# Altium schematic sheet Isolated DAC.SchDoc
size A4
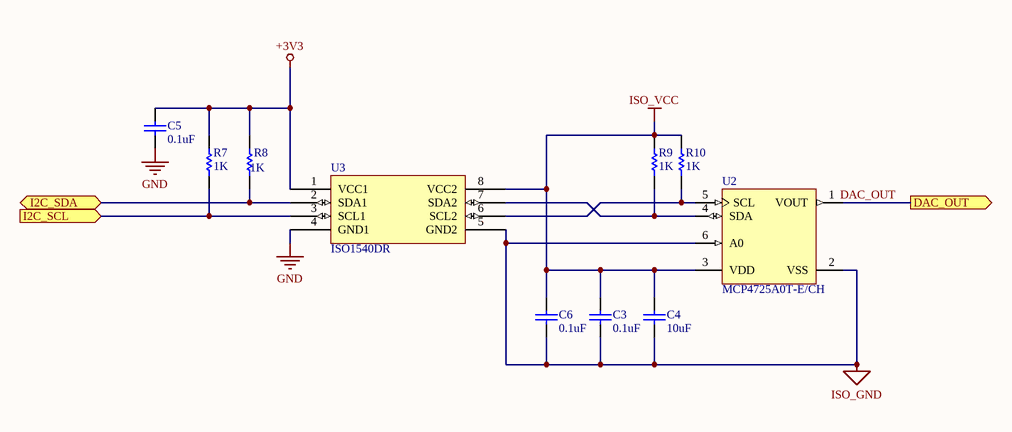
[diagram p0: Isolated DAC.SchDoc]

## Parts
C3  0.1uF  [CAPC1608X87X35NL15T15]
C4  10uF  [CAPC1608X90X35NL10T15]
C5  0.1uF  [CAPC1608X87X35NL15T15]
C6  0.1uF  [CAPC1608X87X35NL15T15]
R7  1K  [RESC1608X55X30LL15T15]
R8  1K  [RESC1608X55X30LL15T15]
R9  1K  [RESC1608X55X30LL15T15]
R10  1K  [RESC1608X55X30LL15T15]
U2  MCP4725A0T-E/CH  [SOT-23-CH6_L]
U3  ISO1540DR  [ISO1540DR SOIC127P600X175-8N]

## Ports
DAC_OUT (out), I2C_SCL (in), I2C_SDA (bidir)

## Nets
+3V3: C5.1 R7.2 R8.2 U3.1(VCC1)
GND: C5.2 U3.4(GND1)
ISO_GND: C3.2 C4.1 C6.2 U2.2(VSS) U2.6(A0) U3.5(GND2)
ISO_VCC: C3.1 C4.2 C6.1 R9.2 R10.2 U2.3(VDD) U3.8(VCC2)
DAC_OUT: U2.1(VOUT) ; port DAC_OUT
I2C_SCL: R7.1 U3.3(SCL1) ; port I2C_SCL
I2C_SDA: R8.1 U3.2(SDA1) ; port I2C_SDA
NetR9_1: R9.1 U2.4(SDA) U3.7(SDA2)
NetR10_1: R10.1 U2.5(SCL) U3.6(SCL2)

## Library data of the parts
C3 C5 C6 = CMP-2006-03300-1: Part Number: C0603X104K5RACTU; Manufacturer: Kemet
C4 = CMP-2006-02792-1: Part Number: GRM188R60J106ME47D; Manufacturer: Murata
R7-R10 = CMP-2000-00180-1: Part Number: ERJ-3EKF1001V; Manufacturer: Panasonic
U2 = CMP-0188-00760-2: 12-Bit Digital-to-Analog Converter with EEPROM Memory in SOT-23-6, 6-Pin SOT-23, Extended Temperature, Tape and Reel; PackageVersion: revBB, Aug-2009; RevisionNote: URLs added.; Code_IPC: SOT26A-6; PackageReference: SOT-23-CH6; ComponentLink1URL: http://www.microchip.com/; ComponentLink3URL: http://www.microchip.com/stellent/groups/techpub_sg/documents/packagingspec/en012702.pdf; PackageDescription: 6-Lead Plastic Small Outline Transistor (CH) [SOT-23]; ComponentLink2URL: http://ww1.microchip.com/downloads/en/DeviceDoc/22039d.pdf; ComponentLink3Description: Package Specification; ComponentLink1Description: Manufacturer URL; ComponentLink2Description: Datasheet; DatasheetVersion: revD, Jun-2009
U3 = ISO1540DR: DGTL ISO 2.5KV 2CH I2C 8SOIC; Manufacturer 1: Texas Instruments; Number of Channels: 2; Working Voltage: 566V; Data Rate: 1Mbps; Min Supply Voltage: 3V; Max Supply Voltage: 5.5V; Channel Type: Bidirectional; Isolated Power: No; Pulse Width Distortion (PWD): 21ns; Propagation Delay: 70ns; Nominal Supply Current: 3.6mA; Supplier 1: Farnell; Manufacturer Part Number 1: ISO1540DR; Stock 1: 2500; Pricing 1: 1=4,68000, 10=3,77000, 25=3,54000, 50=3,32000, 100=3,09000, 250=2,89000, 500=2,21000 (EUR); RoHS: Yes; Mount: Surface Mount; Case/Package: SOIC; Number of Pins: 8; Min Operating Temperature: -40°C; Max Operating Temperature: 125°C; Package Quantity: 1; Packaging: Tape and Reel; REACH SVHC: No SVHC; Lead Free: Lead Free; ComponentLink1URL: https://datasheet.ciiva.com/6579/iso1540-6579723.pdf?src-supplier=Digi-Key; ComponentLink1Description: https://datasheet.ciiva.com/6579/iso1540-6579723.pdf?src-supplier=Digi-Key; ComponentLink2URL: https://datasheet.ciiva.com/6579/iso1540-6579724.pdf?src-supplier=Digi-Key; ComponentLink2Description: https://datasheet.ciiva.com/6579/iso1540-6579724.pdf?src-supplier=Digi-Key; ComponentLink3URL: https://datasheet.ciiva.com/6579/iso1540-6579725.pdf?src-supplier=Digi-Key; ComponentLink3Description: https://datasheet.ciiva.com/6579/iso1540-6579725.pdf?src-supplier=Digi-Key; ComponentLink4URL: https://datasheet.ciiva.com/14196/iso1540-14196749.pdf?src-supplier=Avnet; ComponentLink4Description: https://datasheet.ciiva.com/14196/iso1540-14196749.pdf?src-supplier=Avnet; Supplier Part Number 1: 3124774